# Altium schematic sheet BatteryRegulated.SchDoc
size A
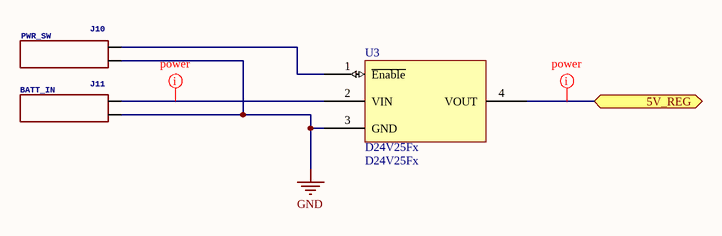
[diagram p0: BatteryRegulated.SchDoc]

## Parts
J10  PWR_SW  [PTH_2.54MM_01X02]
J11  BATT_IN  [PTH_2.54MM_01X02]
U3  D24V25Fx  [D24V50Fx]

## Ports
5V_REG

## Nets
GND: J10.P$1(PIN1) J11.P$1(PIN1) U3.3(GND)
5V_REG: U3.4(VOUT) ; port 5V_REG
NetJ10_P$2: J10.P$2(PIN2) U3.1(~{Enable})
NetJ11_P$2: J11.P$2(PIN2) U3.2(VIN)

## Layout directives
net class power: 5V_REG, NetJ11_P$2

## Library data of the parts
J10 J11 = CON_01X02_PTH_2.54MM: HOUSEPART: YES; MPN: MF-CON-2.54mm-01x02; GateName_1: G$1; POPULATE: 1; SymbolName_1: CON_01X02; DeviceName: _PTH_2.54MM; LibraryName: MF_Connectors; DeviceSetName: CON_01X02; URL: https://factory.macrofab.com/part/MF-CON-2.54mm-01x02
U3 = D24V25Fx: DC Step Down Regulators from Pololu; Name: D24V25Fx